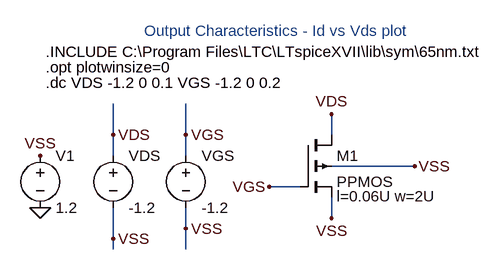
[diagram p0: schematic 6Output Characteristics - Id vs Vds plot pmos.asc]
6Output Characteristics - Id vs Vds plot pmos.asc, the LTspice schematic file:
Version 4
SHEET 1 880 680
WIRE -16 112 -16 64
WIRE 96 112 96 64
WIRE 320 112 320 80
WIRE -16 144 -16 112
WIRE 96 144 96 112
WIRE 448 160 320 160
WIRE 272 192 224 192
WIRE 320 240 320 208
WIRE 96 256 96 224
WIRE -16 272 -16 224
WIRE -16 288 -16 272
WIRE 96 288 96 256
FLAG 96 112 VGS
FLAG -16 112 VDS
FLAG -128 144 VSS
FLAG -128 224 0
FLAG -16 272 VSS
FLAG 96 256 VSS
FLAG 224 192 VGS
FLAG 320 80 VDS
FLAG 320 240 VSS
FLAG 448 160 VSS
SYMBOL voltage -16 128 R0
SYMATTR InstName VDS
SYMATTR Value -1.2
SYMBOL voltage 96 128 R0
WINDOW 123 0 0 Left 0
WINDOW 39 0 0 Left 0
SYMATTR InstName VGS
SYMATTR Value -1.2
SYMBOL voltage -128 128 R0
SYMATTR InstName V1
SYMATTR Value 1.2
SYMBOL pmos4 272 112 R0
WINDOW 123 56 94 Left 2
SYMATTR InstName M1
SYMATTR Value PPMOS
SYMATTR Value2 l=0.06U w=2U
TEXT -120 -16 Left 2 !.INCLUDE C:\\Program Files\\LTC\\LTspiceXVII\\lib\\sym\\65nm.txt
TEXT -120 8 Left 2 !.opt plotwinsize=0
TEXT -120 32 Left 2 !.dc VDS -1.2 0 0.1 VGS -1.2 0 0.2
TEXT 32 -48 Left 2 ;Output Characteristics - Id vs Vds plot

The netlist it stands for:
* 6Output Characteristics - Id vs Vds plot pmos.asc
VDS VDS VSS -1.2
VGS VGS VSS -1.2
V1 VSS 0 1.2
M1 VDS VGS VSS VSS PPMOS l=0.06U w=2U
.model NMOS NMOS
.model PMOS PMOS
.lib standard.mos
.INCLUDE C:\Program Files\LTC\LTspiceXVII\lib\sym\65nm.txt
.opt plotwinsize=0
.dc VDS -1.2 0 0.1 VGS -1.2 0 0.2
* Output Characteristics - Id vs Vds plot
.backanno
.end